# Altium schematic sheet PPC405_RAM.SCHDOC: FPGA PPC405 RAM example
size C; Organization: Altium Limited; Address1: L3, 12a Rodborough Rd; Address2: Frenchs Forest; Address3: NSW; Address4: Australia 2086; DocumentNumber: 1; SheetNumber: 1; SheetTotal: 1
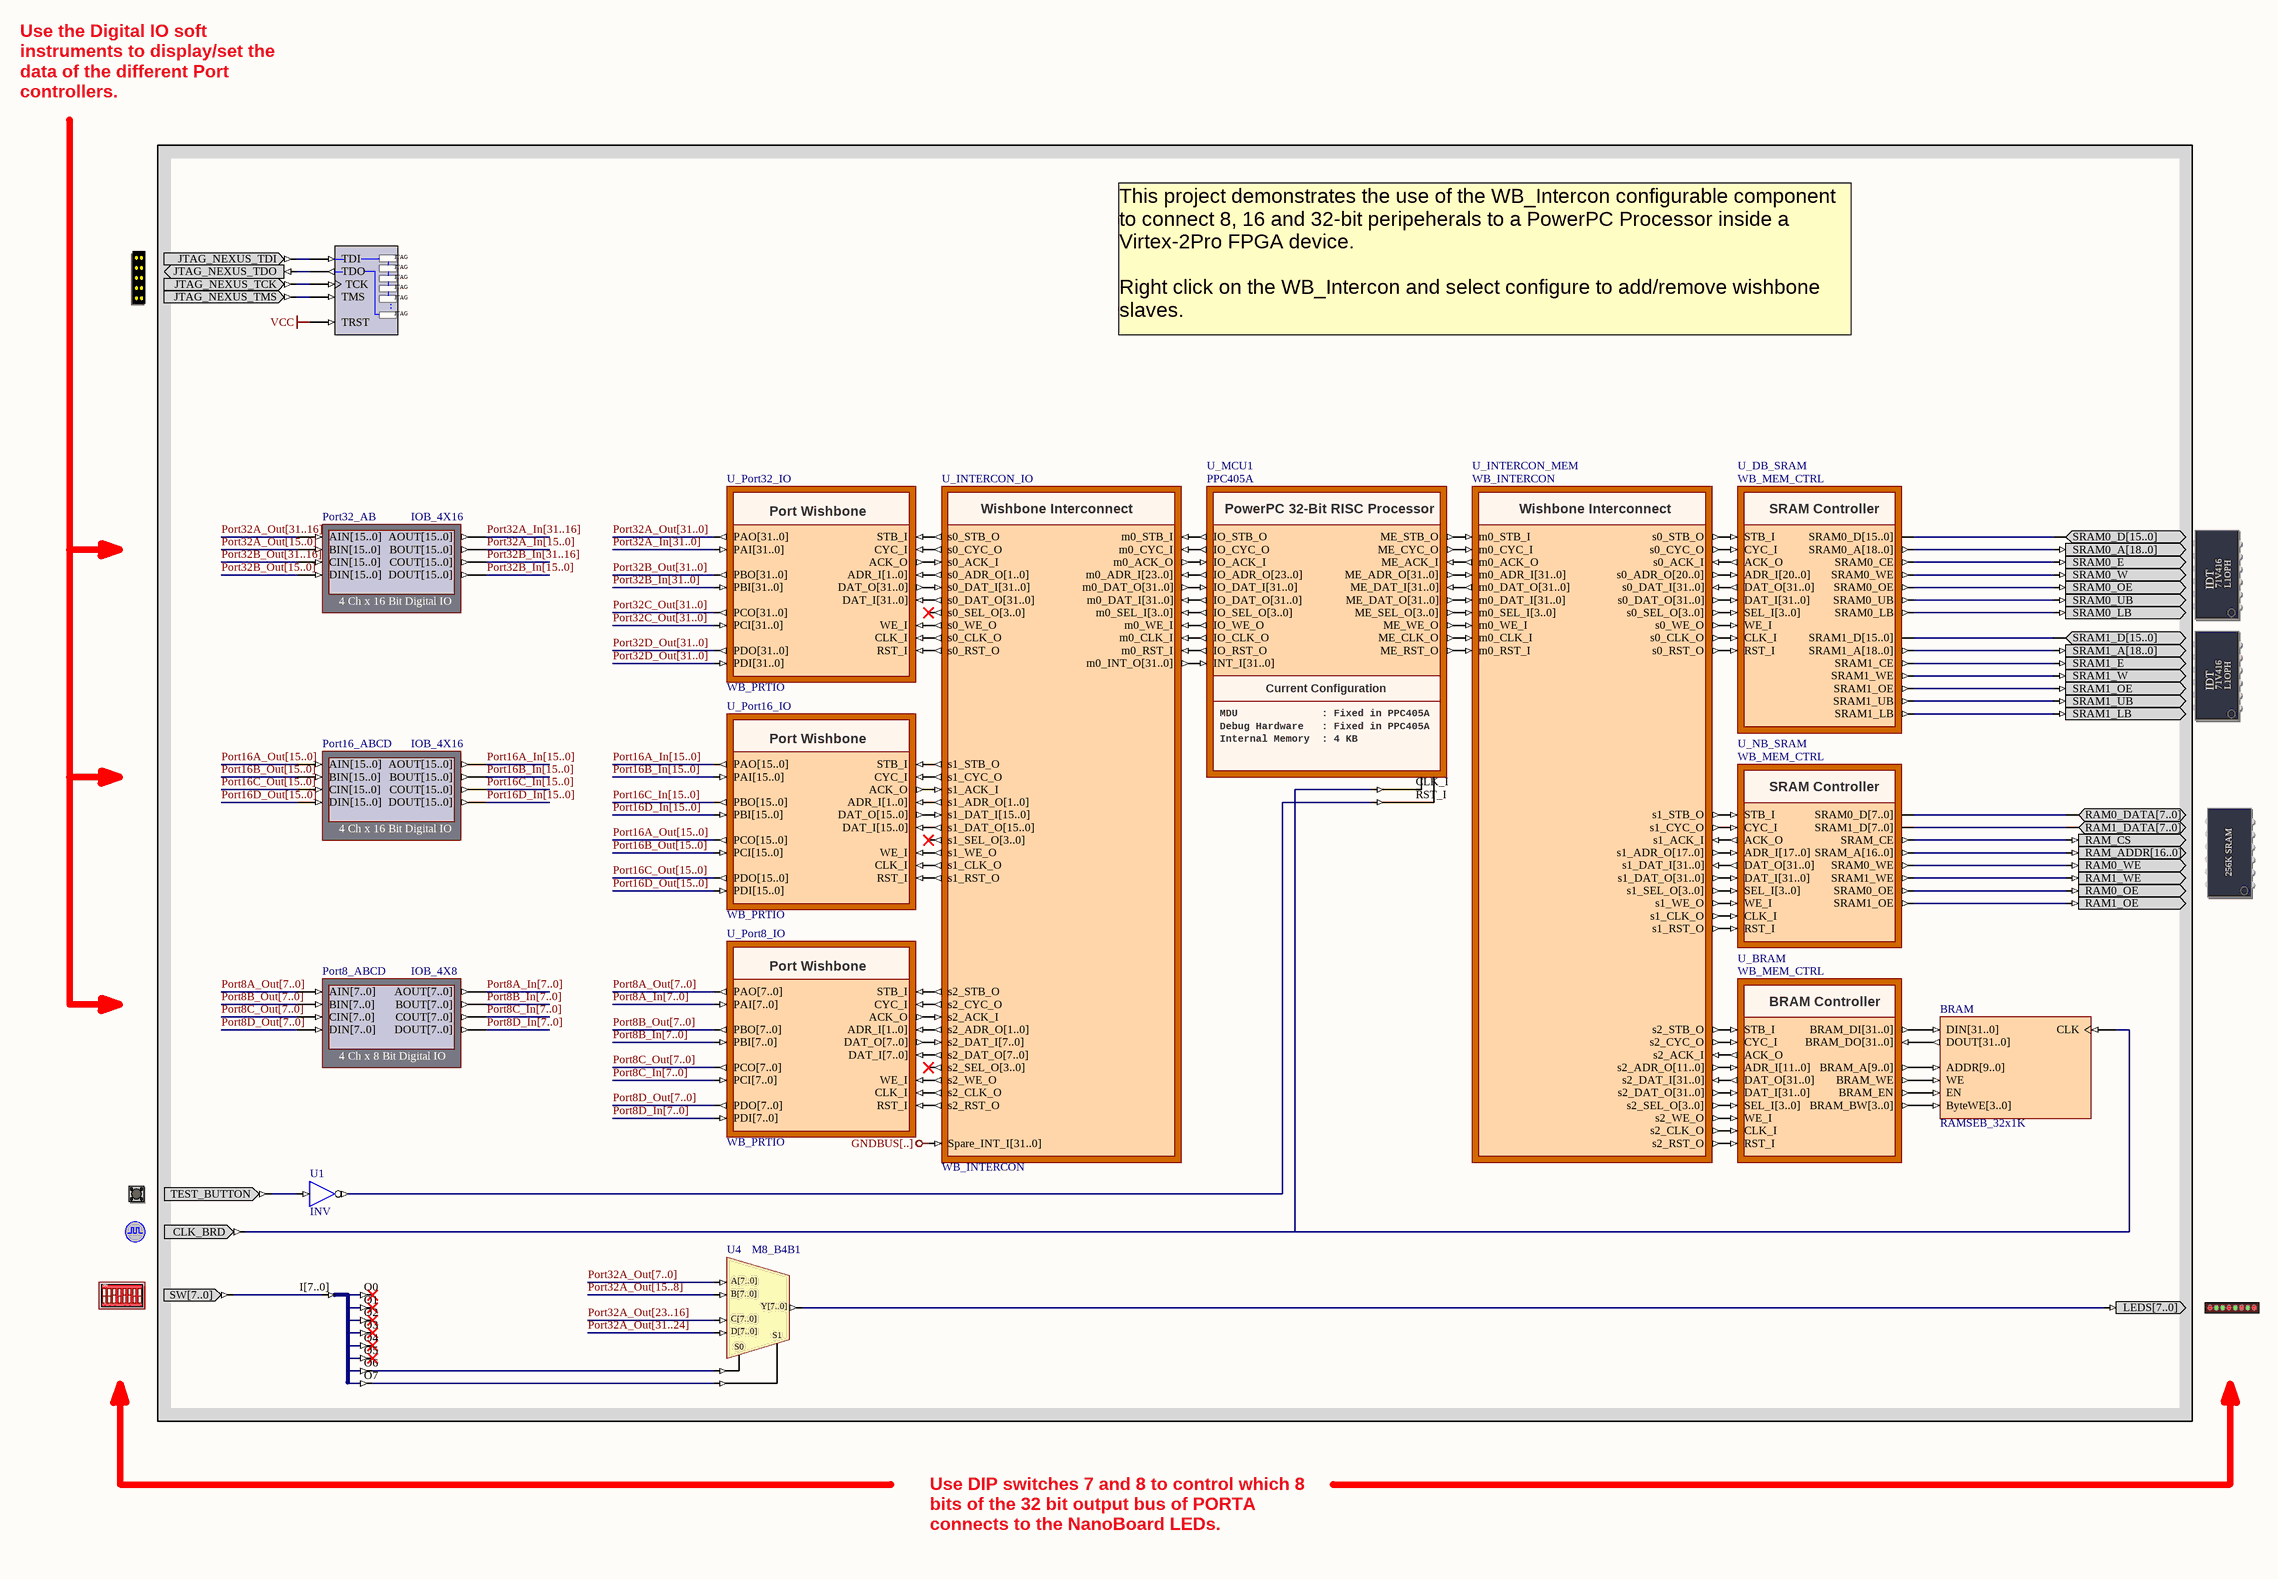
[diagram p0: PPC405_RAM.SCHDOC]

## Parts
(Parts that share a designator on the sheet are numbered #1, #2 ... from top to bottom, then left to right.)
?#1  NEXUS_JTAG_CONNECTOR  (value not drawn)
?#2  SRAM_DAUGHTER0  (value not drawn)
?#3  SRAM_DAUGHTER1  (value not drawn)
?#4  MEMORY256KX8  (value not drawn)
?#5  TEST_BUTTON  (value not drawn)
?#6  CLOCK_BOARD  (value not drawn)
?#7  DIPSWITCH  (value not drawn)
?#8  LED  (value not drawn)
BRAM  RAMSEB_32x1K
NEXUS_JTAG_PORT  NEXUS_JTAG_PORT  (value not drawn)
Port8_ABCD  IOB_4X8
Port16_ABCD  IOB_4X16
Port32_AB  IOB_4X16
U1  INV
U4  M8_B4B1
U11  J8B_8S  (value not drawn)
U_BRAM  WB_MEM_CTRL
U_DB_SRAM  WB_MEM_CTRL
U_INTERCON_IO  WB_INTERCON
U_INTERCON_MEM  WB_INTERCON
U_MCU1  PPC405A
U_NB_SRAM  WB_MEM_CTRL
U_Port8_IO  WB_PRTIO
U_Port16_IO  WB_PRTIO
U_Port32_IO  WB_PRTIO

## Nets
GNDBUS[..]: U_INTERCON_IO.Spare_INT_I[31..0]
VCC: NEXUS_JTAG_PORT.TRST
Port8A_In[7..0]: Port8_ABCD.AOUT[7..0] U_Port8_IO.PAI[7..0]
Port8A_Out[7..0]: Port8_ABCD.AIN[7..0] U_Port8_IO.PAO[7..0]
Port8B_In[7..0]: Port8_ABCD.BOUT[7..0] U_Port8_IO.PBI[7..0]
Port8B_Out[7..0]: Port8_ABCD.BIN[7..0] U_Port8_IO.PBO[7..0]
Port8C_In[7..0]: Port8_ABCD.COUT[7..0] U_Port8_IO.PCI[7..0]
Port8C_Out[7..0]: Port8_ABCD.CIN[7..0] U_Port8_IO.PCO[7..0]
Port8D_In[7..0]: Port8_ABCD.DOUT[7..0] U_Port8_IO.PDI[7..0]
Port8D_Out[7..0]: Port8_ABCD.DIN[7..0] U_Port8_IO.PDO[7..0]
Port16A_In[15..0]: Port16_ABCD.AOUT[15..0] U_Port16_IO.PAO[15..0]
Port16A_Out[15..0]: Port16_ABCD.AIN[15..0] U_Port16_IO.PCO[15..0]
Port16B_In[15..0]: Port16_ABCD.BOUT[15..0] U_Port16_IO.PAI[15..0]
Port16B_Out[15..0]: Port16_ABCD.BIN[15..0] U_Port16_IO.PCI[15..0]
Port16C_In[15..0]: Port16_ABCD.COUT[15..0] U_Port16_IO.PBO[15..0]
Port16C_Out[15..0]: Port16_ABCD.CIN[15..0] U_Port16_IO.PDO[15..0]
Port16D_In[15..0]: Port16_ABCD.DOUT[15..0] U_Port16_IO.PBI[15..0]
Port16D_Out[15..0]: Port16_ABCD.DIN[15..0] U_Port16_IO.PDI[15..0]
Port32A_In[15..0]: Port32_AB.BOUT[15..0]
Port32A_In[31..0]: U_Port32_IO.PAI[31..0]
Port32A_In[31..16]: Port32_AB.AOUT[15..0]
Port32A_Out[7..0]: U4.A[7..0]
Port32A_Out[15..0]: Port32_AB.BIN[15..0]
Port32A_Out[15..8]: U4.B[7..0]
Port32A_Out[23..16]: U4.C[7..0]
Port32A_Out[31..0]: U_Port32_IO.PAO[31..0]
Port32A_Out[31..16]: Port32_AB.AIN[15..0]
Port32A_Out[31..24]: U4.D[7..0]
Port32B_In[15..0]: Port32_AB.DOUT[15..0]
Port32B_In[31..0]: U_Port32_IO.PBI[31..0]
Port32B_In[31..16]: Port32_AB.COUT[15..0]
Port32B_Out[15..0]: Port32_AB.DIN[15..0]
Port32B_Out[31..0]: U_Port32_IO.PBO[31..0]
Port32B_Out[31..16]: Port32_AB.CIN[15..0]
Port32C_Out[31..0]: U_Port32_IO.PCI[31..0] U_Port32_IO.PCO[31..0]
Port32D_Out[31..0]: U_Port32_IO.PDI[31..0] U_Port32_IO.PDO[31..0]
Net?#1_JTAG_NEXUS_TCK: ?#1.JTAG_NEXUS_TCK NEXUS_JTAG_PORT.TCK
Net?#1_JTAG_NEXUS_TDI: ?#1.JTAG_NEXUS_TDI NEXUS_JTAG_PORT.TDI
Net?#1_JTAG_NEXUS_TDO: ?#1.JTAG_NEXUS_TDO NEXUS_JTAG_PORT.TDO
Net?#1_JTAG_NEXUS_TMS: ?#1.JTAG_NEXUS_TMS NEXUS_JTAG_PORT.TMS
Net?#2_SRAM0_A[18..0]: ?#2.SRAM0_A[18..0] U_DB_SRAM.SRAM0_A[18..0]
Net?#2_SRAM0_D[15..0]: ?#2.SRAM0_D[15..0] U_DB_SRAM.SRAM0_D[15..0]
Net?#2_SRAM0_E: ?#2.SRAM0_E U_DB_SRAM.SRAM0_CE
Net?#2_SRAM0_LB: ?#2.SRAM0_LB U_DB_SRAM.SRAM0_LB
Net?#2_SRAM0_OE: ?#2.SRAM0_OE U_DB_SRAM.SRAM0_OE
Net?#2_SRAM0_UB: ?#2.SRAM0_UB U_DB_SRAM.SRAM0_UB
Net?#2_SRAM0_W: ?#2.SRAM0_W U_DB_SRAM.SRAM0_WE
Net?#3_SRAM1_A[18..0]: ?#3.SRAM1_A[18..0] U_DB_SRAM.SRAM1_A[18..0]
Net?#3_SRAM1_D[15..0]: ?#3.SRAM1_D[15..0] U_DB_SRAM.SRAM1_D[15..0]
Net?#3_SRAM1_E: ?#3.SRAM1_E U_DB_SRAM.SRAM1_CE
Net?#3_SRAM1_LB: ?#3.SRAM1_LB U_DB_SRAM.SRAM1_LB
Net?#3_SRAM1_OE: ?#3.SRAM1_OE U_DB_SRAM.SRAM1_OE
Net?#3_SRAM1_UB: ?#3.SRAM1_UB U_DB_SRAM.SRAM1_UB
Net?#3_SRAM1_W: ?#3.SRAM1_W U_DB_SRAM.SRAM1_WE
Net?#4_RAM0_DATA[7..0]: ?#4.RAM0_DATA[7..0] U_NB_SRAM.SRAM0_D[7..0]
Net?#4_RAM0_OE: ?#4.RAM0_OE U_NB_SRAM.SRAM0_OE
Net?#4_RAM0_WE: ?#4.RAM0_WE U_NB_SRAM.SRAM0_WE
Net?#4_RAM1_DATA[7..0]: ?#4.RAM1_DATA[7..0] U_NB_SRAM.SRAM1_D[7..0]
Net?#4_RAM1_OE: ?#4.RAM1_OE U_NB_SRAM.SRAM1_OE
Net?#4_RAM1_WE: ?#4.RAM1_WE U_NB_SRAM.SRAM1_WE
Net?#4_RAM_ADDR[16..0]: ?#4.RAM_ADDR[16..0] U_NB_SRAM.SRAM_A[16..0]
Net?#4_RAM_CS: ?#4.RAM_CS U_NB_SRAM.SRAM_CE
Net?#5_TEST_BUTTON: ?#5.TEST_BUTTON U1.I
Net?#6_CLK_BRD: ?#6.CLK_BRD BRAM.CLK U_MCU1.CLK_I
Net?#7_SW[7..0]: ?#7.SW[7..0] U11.I[7..0]
Net?#8_LEDS[7..0]: ?#8.LEDS[7..0] U4.Y[7..0]
NetBRAM_ADDR[9..0]: BRAM.ADDR[9..0] U_BRAM.BRAM_A[9..0]
NetBRAM_ByteWE[3..0]: BRAM.ByteWE[3..0] U_BRAM.BRAM_BW[3..0]
NetBRAM_DIN[31..0]: BRAM.DIN[31..0] U_BRAM.BRAM_DI[31..0]
NetBRAM_DOUT[31..0]: BRAM.DOUT[31..0] U_BRAM.BRAM_DO[31..0]
NetBRAM_EN: BRAM.EN U_BRAM.BRAM_EN
NetBRAM_WE: BRAM.WE U_BRAM.BRAM_WE
NetU1_O: U1.O U_MCU1.RST_I
NetU4_S0: U4.S0 U11.O6
NetU4_S1: U4.S1 U11.O7
NetU_BRAM_ACK_O: U_BRAM.ACK_O U_INTERCON_MEM.s2_ACK_I
NetU_BRAM_ADR_I[11..0]: U_BRAM.ADR_I[11..0] U_INTERCON_MEM.s2_ADR_O[11..0]
NetU_BRAM_CLK_I: U_BRAM.CLK_I U_INTERCON_MEM.s2_CLK_O
NetU_BRAM_CYC_I: U_BRAM.CYC_I U_INTERCON_MEM.s2_CYC_O
NetU_BRAM_DAT_I[31..0]: U_BRAM.DAT_I[31..0] U_INTERCON_MEM.s2_DAT_O[31..0]
NetU_BRAM_DAT_O[31..0]: U_BRAM.DAT_O[31..0] U_INTERCON_MEM.s2_DAT_I[31..0]
NetU_BRAM_RST_I: U_BRAM.RST_I U_INTERCON_MEM.s2_RST_O
NetU_BRAM_SEL_I[3..0]: U_BRAM.SEL_I[3..0] U_INTERCON_MEM.s2_SEL_O[3..0]
NetU_BRAM_STB_I: U_BRAM.STB_I U_INTERCON_MEM.s2_STB_O
NetU_BRAM_WE_I: U_BRAM.WE_I U_INTERCON_MEM.s2_WE_O
NetU_DB_SRAM_ACK_O: U_DB_SRAM.ACK_O U_INTERCON_MEM.s0_ACK_I
NetU_DB_SRAM_ADR_I[20..0]: U_DB_SRAM.ADR_I[20..0] U_INTERCON_MEM.s0_ADR_O[20..0]
NetU_DB_SRAM_CLK_I: U_DB_SRAM.CLK_I U_INTERCON_MEM.s0_CLK_O
NetU_DB_SRAM_CYC_I: U_DB_SRAM.CYC_I U_INTERCON_MEM.s0_CYC_O
NetU_DB_SRAM_DAT_I[31..0]: U_DB_SRAM.DAT_I[31..0] U_INTERCON_MEM.s0_DAT_O[31..0]
NetU_DB_SRAM_DAT_O[31..0]: U_DB_SRAM.DAT_O[31..0] U_INTERCON_MEM.s0_DAT_I[31..0]
NetU_DB_SRAM_RST_I: U_DB_SRAM.RST_I U_INTERCON_MEM.s0_RST_O
NetU_DB_SRAM_SEL_I[3..0]: U_DB_SRAM.SEL_I[3..0] U_INTERCON_MEM.s0_SEL_O[3..0]
NetU_DB_SRAM_STB_I: U_DB_SRAM.STB_I U_INTERCON_MEM.s0_STB_O
NetU_DB_SRAM_WE_I: U_DB_SRAM.WE_I U_INTERCON_MEM.s0_WE_O
NetU_INTERCON_IO_m0_ACK_O: U_INTERCON_IO.m0_ACK_O U_MCU1.IO_ACK_I
NetU_INTERCON_IO_m0_ADR_I[23..0]: U_INTERCON_IO.m0_ADR_I[23..0] U_MCU1.IO_ADR_O[23..0]
NetU_INTERCON_IO_m0_CLK_I: U_INTERCON_IO.m0_CLK_I U_MCU1.IO_CLK_O
NetU_INTERCON_IO_m0_CYC_I: U_INTERCON_IO.m0_CYC_I U_MCU1.IO_CYC_O
NetU_INTERCON_IO_m0_DAT_I[31..0]: U_INTERCON_IO.m0_DAT_I[31..0] U_MCU1.IO_DAT_O[31..0]
NetU_INTERCON_IO_m0_DAT_O[31..0]: U_INTERCON_IO.m0_DAT_O[31..0] U_MCU1.IO_DAT_I[31..0]
NetU_INTERCON_IO_m0_INT_O[31..0]: U_INTERCON_IO.m0_INT_O[31..0] U_MCU1.INT_I[31..0]
NetU_INTERCON_IO_m0_RST_I: U_INTERCON_IO.m0_RST_I U_MCU1.IO_RST_O
NetU_INTERCON_IO_m0_SEL_I[3..0]: U_INTERCON_IO.m0_SEL_I[3..0] U_MCU1.IO_SEL_O[3..0]
NetU_INTERCON_IO_m0_STB_I: U_INTERCON_IO.m0_STB_I U_MCU1.IO_STB_O
NetU_INTERCON_IO_m0_WE_I: U_INTERCON_IO.m0_WE_I U_MCU1.IO_WE_O
NetU_INTERCON_IO_s0_ACK_I: U_INTERCON_IO.s0_ACK_I U_Port32_IO.ACK_O
NetU_INTERCON_IO_s0_ADR_O[1..0]: U_INTERCON_IO.s0_ADR_O[1..0] U_Port32_IO.ADR_I[1..0]
NetU_INTERCON_IO_s0_CLK_O: U_INTERCON_IO.s0_CLK_O U_Port32_IO.CLK_I
NetU_INTERCON_IO_s0_CYC_O: U_INTERCON_IO.s0_CYC_O U_Port32_IO.CYC_I
NetU_INTERCON_IO_s0_DAT_I[31..0]: U_INTERCON_IO.s0_DAT_I[31..0] U_Port32_IO.DAT_O[31..0]
NetU_INTERCON_IO_s0_DAT_O[31..0]: U_INTERCON_IO.s0_DAT_O[31..0] U_Port32_IO.DAT_I[31..0]
NetU_INTERCON_IO_s0_RST_O: U_INTERCON_IO.s0_RST_O U_Port32_IO.RST_I
NetU_INTERCON_IO_s0_STB_O: U_INTERCON_IO.s0_STB_O U_Port32_IO.STB_I
NetU_INTERCON_IO_s0_WE_O: U_INTERCON_IO.s0_WE_O U_Port32_IO.WE_I
NetU_INTERCON_IO_s1_ACK_I: U_INTERCON_IO.s1_ACK_I U_Port16_IO.ACK_O
NetU_INTERCON_IO_s1_ADR_O[1..0]: U_INTERCON_IO.s1_ADR_O[1..0] U_Port16_IO.ADR_I[1..0]
NetU_INTERCON_IO_s1_CLK_O: U_INTERCON_IO.s1_CLK_O U_Port16_IO.CLK_I
NetU_INTERCON_IO_s1_CYC_O: U_INTERCON_IO.s1_CYC_O U_Port16_IO.CYC_I
NetU_INTERCON_IO_s1_DAT_I[15..0]: U_INTERCON_IO.s1_DAT_I[15..0] U_Port16_IO.DAT_O[15..0]
NetU_INTERCON_IO_s1_DAT_O[15..0]: U_INTERCON_IO.s1_DAT_O[15..0] U_Port16_IO.DAT_I[15..0]
NetU_INTERCON_IO_s1_RST_O: U_INTERCON_IO.s1_RST_O U_Port16_IO.RST_I
NetU_INTERCON_IO_s1_STB_O: U_INTERCON_IO.s1_STB_O U_Port16_IO.STB_I
NetU_INTERCON_IO_s1_WE_O: U_INTERCON_IO.s1_WE_O U_Port16_IO.WE_I
NetU_INTERCON_IO_s2_ACK_I: U_INTERCON_IO.s2_ACK_I U_Port8_IO.ACK_O
NetU_INTERCON_IO_s2_ADR_O[1..0]: U_INTERCON_IO.s2_ADR_O[1..0] U_Port8_IO.ADR_I[1..0]
NetU_INTERCON_IO_s2_CLK_O: U_INTERCON_IO.s2_CLK_O U_Port8_IO.CLK_I
NetU_INTERCON_IO_s2_CYC_O: U_INTERCON_IO.s2_CYC_O U_Port8_IO.CYC_I
NetU_INTERCON_IO_s2_DAT_I[7..0]: U_INTERCON_IO.s2_DAT_I[7..0] U_Port8_IO.DAT_O[7..0]
NetU_INTERCON_IO_s2_DAT_O[7..0]: U_INTERCON_IO.s2_DAT_O[7..0] U_Port8_IO.DAT_I[7..0]
NetU_INTERCON_IO_s2_RST_O: U_INTERCON_IO.s2_RST_O U_Port8_IO.RST_I
NetU_INTERCON_IO_s2_STB_O: U_INTERCON_IO.s2_STB_O U_Port8_IO.STB_I
NetU_INTERCON_IO_s2_WE_O: U_INTERCON_IO.s2_WE_O U_Port8_IO.WE_I
NetU_INTERCON_MEM_m0_ACK_O: U_INTERCON_MEM.m0_ACK_O U_MCU1.ME_ACK_I
NetU_INTERCON_MEM_m0_ADR_I[31..0]: U_INTERCON_MEM.m0_ADR_I[31..0] U_MCU1.ME_ADR_O[31..0]
NetU_INTERCON_MEM_m0_CLK_I: U_INTERCON_MEM.m0_CLK_I U_MCU1.ME_CLK_O
NetU_INTERCON_MEM_m0_CYC_I: U_INTERCON_MEM.m0_CYC_I U_MCU1.ME_CYC_O
NetU_INTERCON_MEM_m0_DAT_I[31..0]: U_INTERCON_MEM.m0_DAT_I[31..0] U_MCU1.ME_DAT_O[31..0]
NetU_INTERCON_MEM_m0_DAT_O[31..0]: U_INTERCON_MEM.m0_DAT_O[31..0] U_MCU1.ME_DAT_I[31..0]
NetU_INTERCON_MEM_m0_RST_I: U_INTERCON_MEM.m0_RST_I U_MCU1.ME_RST_O
NetU_INTERCON_MEM_m0_SEL_I[3..0]: U_INTERCON_MEM.m0_SEL_I[3..0] U_MCU1.ME_SEL_O[3..0]
NetU_INTERCON_MEM_m0_STB_I: U_INTERCON_MEM.m0_STB_I U_MCU1.ME_STB_O
NetU_INTERCON_MEM_m0_WE_I: U_INTERCON_MEM.m0_WE_I U_MCU1.ME_WE_O
NetU_INTERCON_MEM_s1_ACK_I: U_INTERCON_MEM.s1_ACK_I U_NB_SRAM.ACK_O
NetU_INTERCON_MEM_s1_ADR_O[17..0]: U_INTERCON_MEM.s1_ADR_O[17..0] U_NB_SRAM.ADR_I[17..0]
NetU_INTERCON_MEM_s1_CLK_O: U_INTERCON_MEM.s1_CLK_O U_NB_SRAM.CLK_I
NetU_INTERCON_MEM_s1_CYC_O: U_INTERCON_MEM.s1_CYC_O U_NB_SRAM.CYC_I
NetU_INTERCON_MEM_s1_DAT_I[31..0]: U_INTERCON_MEM.s1_DAT_I[31..0] U_NB_SRAM.DAT_O[31..0]
NetU_INTERCON_MEM_s1_DAT_O[31..0]: U_INTERCON_MEM.s1_DAT_O[31..0] U_NB_SRAM.DAT_I[31..0]
NetU_INTERCON_MEM_s1_RST_O: U_INTERCON_MEM.s1_RST_O U_NB_SRAM.RST_I
NetU_INTERCON_MEM_s1_SEL_O[3..0]: U_INTERCON_MEM.s1_SEL_O[3..0] U_NB_SRAM.SEL_I[3..0]
NetU_INTERCON_MEM_s1_STB_O: U_INTERCON_MEM.s1_STB_O U_NB_SRAM.STB_I
NetU_INTERCON_MEM_s1_WE_O: U_INTERCON_MEM.s1_WE_O U_NB_SRAM.WE_I

Not connected (* = marked no-connect by the designer): U11 O0* O1* O2* O3* O4* O5*; U_INTERCON_IO s0_SEL_O[3..0]* s1_SEL_O[3..0]* s2_SEL_O[3..0]*

## Buses and harness runs
bus Port8A_In[7..0]
bus Port8A_Out[7..0]
bus Port8B_In[7..0]
bus Port8B_Out[7..0]
bus Port8C_In[7..0]
bus Port8C_Out[7..0]
bus Port8D_In[7..0]
bus Port8D_Out[7..0]
bus Port16A_In[15..0]
bus Port16A_Out[15..0]
bus Port16B_In[15..0]
bus Port16B_Out[15..0]
bus Port16C_In[15..0]
bus Port16C_Out[15..0]
bus Port16D_In[15..0]
bus Port16D_Out[15..0]
bus Port32A_In[15..0]
bus Port32A_In[31..0]
bus Port32A_In[31..16]
bus Port32A_Out[7..0]
bus Port32A_Out[15..0]
bus Port32A_Out[15..8]
bus Port32A_Out[23..16]
bus Port32A_Out[31..0]
bus Port32A_Out[31..16]
bus Port32A_Out[31..24]
bus Port32B_In[15..0]
bus Port32B_In[31..0]
bus Port32B_In[31..16]
bus Port32B_Out[15..0]
bus Port32B_Out[31..0]
bus Port32B_Out[31..16]
bus Port32C_Out[31..0]
bus Port32D_Out[31..0]

## Notes on the sheet
- Use the Digital IO soft instruments to display/set the data of the different Port controllers.
- This project demonstrates the use of the WB_Intercon configurable component to connect 8, 16 and 32-bit peripeherals to a PowerPC Processor inside a Virtex-2Pro FPGA device.
  Right click on the WB_Intercon and select configure to add/remove wishbone slaves.
- Use DIP switches 7 and 8 to control which 8 bits of the 32 bit output bus of PORTA connects to the NanoBoard LEDs.
- Title
- Size:
- Date:
- File:
- C
- Number:
- Time:
- Revision:
- Sheet
- of
- (in symbol DIPSWITCH) ON; 1; 2; 3; 4; 5; 6; 7; 8
- (in symbol MEMORY256KX8) 256K SRAM
- (in symbol NEXUS_JTAG_PORT) JTAG; .
- (in symbol PPC405A) PowerPC 32-Bit RISC Processor; Current Configuration; MDU              : Fixed in PPC405A; Debug Hardware   : Fixed in PPC405A; Internal Memory  : 4 KB
- (in symbol SRAM_DAUGHTER0) IDT; 71V416; L1OPH
- (in symbol SRAM_DAUGHTER1) IDT; 71V416; L1OPH
- (in symbol WB_INTERCON) Wishbone Interconnect
- (in symbol WB_MEM_CTRL) BRAM Controller; SRAM Controller
- (in symbol WB_PRTIO) Port Wishbone

## Library data of the parts
?#1 = NEXUS_JTAG_CONNECTOR: JTAG Port; PortComponent: True; Published: 19-Nov-2003; Publisher: Altium Limited
?#2 = SRAM_DAUGHTER0: SRAM - 0 Module - Daughterboard; PortComponent: True; Published: 13-May-2004; Publisher: Altium Limited
?#3 = SRAM_DAUGHTER1: SRAM - 1 Module - Daughterboard; PortComponent: True; Published: 13-May-2004; Publisher: Altium Limited
?#4 = MEMORY256KX8: SRAM 256kx8; PortComponent: True; Published: 19-Nov-2003; Publisher: Altium Limited; HelpURL: TR0102 NanoBoard Technical Reference Manual - NB1.pdf#page=33
?#5 = TEST_BUTTON: Test Button; PortComponent: True; Published: 19-Nov-2003; Publisher: Altium Limited
?#6 = CLOCK_BOARD: Global System Clock Supply; PortComponent: True; Published: 19-Nov-2003; Publisher: Altium Limited
?#7 = DIPSWITCH: 8-Way Dip Switch; PortComponent: True; Published: 19-Nov-2003; Publisher: Altium Limited
?#8 = LED: 8-Way LEDS; PortComponent: True; Published: 19-Nov-2003; Publisher: Altium Limited
BRAM = RAMSEB_32x1K: Single Port RAM, Enable, Byte Write Enable; Memory_Type: RAM_SinglePortBlock; Memory_ClockEdge: Rising; Nexus_Core: Memory_Program; Memory_EnablePin: True; Memory_Depth: 1024; Memory_Width: 32; Published: 11/10/2004; Publisher: Altium Hobart Technology Center; Memory_ByteWrites: True
NEXUS_JTAG_PORT = NEXUS_JTAG_PORT: Soft Nexus-Chain Connector; NEXUS_JTAG_CONNECTOR: True; Published: 18-Dec-2003; Publisher: Altium Limited
Port8_ABCD = IOB_4X8: 4 Ch x 8 Bit Digital IO; NEXUS_CORE: Instrument; NEXUS_JTAG_DEVICE: True; NEXUS_JTAG_ORDER: 50; Published: 3-Nov-2004; Publisher: Altium Limited; ComponentLink1Description: Core &Resource Usage; ComponentLink1URL: CR0134 FPGA Instrument Resource Usage.pdf#page=8; HelpURL: CR0102 IOB_x Digital IO Module.pdf#page=2; LastRevisionNo: 1.00.00
Port16_ABCD = IOB_4X16: 4 Ch x 16 Bit Digital IO; NEXUS_CORE: Instrument; NEXUS_JTAG_DEVICE: True; NEXUS_JTAG_ORDER: 40; Published: 3-Nov-2004; Publisher: Altium Limited; ComponentLink1Description: Core &Resource Usage; ComponentLink1URL: CR0134 FPGA Instrument Resource Usage.pdf#page=9; HelpURL: CR0102 IOB_x Digital IO Module.pdf#page=2; LastRevisionNo: 1.00.00
Port32_AB = IOB_4X16: 4 Ch x 16 Bit Digital IO; NEXUS_CORE: Instrument; NEXUS_JTAG_DEVICE: True; NEXUS_JTAG_ORDER: 30; Published: 3-Nov-2004; Publisher: Altium Limited; ComponentLink1Description: Core &Resource Usage; ComponentLink1URL: CR0134 FPGA Instrument Resource Usage.pdf#page=9; HelpURL: CR0102 IOB_x Digital IO Module.pdf#page=2; LastRevisionNo: 1.00.00
U1 = INV: Inverter; ArchiveName: GENERIC; FunctionalClass: Logic Primitive; VHDLIB_SIM: GENERIC_LIB; Published: 29-Jan-2004; Publisher: Altium Limited; ComponentLink1Description: Core &Resource Usage; ComponentLink1URL: CR0136 FPGA Logic Primitive Resource Usage.pdf#page=61; HelpURL: CR0118 FPGA Generic Library Guide.pdf#page=290; LastRevisionNo: 1.00.00; SubClass: INV; XilinxEquivalent: INV
U4 = M8_B4B1: 4x8-Bit Bus to 1x8-Bit Bus Multiplexer; ArchiveName: GENERIC; VHDLIB_SIM: GENERIC_LIB; PortSize: 8; PortStyle: Bus Version; SubClass: BnB1; Published: 29-Jan-2004; Publisher: Altium Limited; HelpURL: CR0118 FPGA Generic Library Guide.pdf#page=364; ComponentLink1Description: Core &Resource Usage; ComponentLink1URL: CR0137 FPGA Multiplexer Resource Usage.pdf#page=304; FunctionalClass: Multiplexer; LastRevisionNo: 1.00.00
U11 = J8B_8S: 8-Bit input bus to 8 single pin outputs; ArchiveName: GENERIC; VHDLIB_SIM: GENERIC_LIB; FunctionalClass: Bus Joiner; PortSize: 8; Published: 29-Jan-2004; Publisher: Altium Limited; ComponentLink1Description: Core &Resource Usage; ComponentLink1URL: CR0126 FPGA Bus Joiner Resource Usage.pdf#page=27; HelpURL: CR0118 FPGA Generic Library Guide.pdf#page=303; LastRevisionNo: 1.00.00
U_BRAM = WB_MEM_CTRL: Configurable Memory Controller; ConfigurationParameters: {}Option_MemoryType[Block RAM]{}Option_MemorySize[4 Kb (1K x 32-bit)]{}Option_Layout[2 x 16-bit Wide Devices]{}Option_Read[2]{}Option_WriteSetup[1]{}Option_WritePulse[1]{}Option_WriteHold[1]{}; ComponentLink1Description: Core &Resource Usage; ComponentLink1URL: CR0139 FPGA Peripheral Resource Usage.pdf#page=58; HelpURL: CR0152 WB_MEM_CTRL Configurable Wishbone Memory Controller.pdf#page=2; LastRevisionNo: 1.00.00; Published: 9-Dec-2004; Publisher: Altium Limited; ConfiguratorName: WB_MEM_CTRL
U_DB_SRAM = WB_MEM_CTRL: Configurable Memory Controller; ConfigurationParameters: {}Option_MemoryType[Asynchronous SRAM]{}Option_MemorySize[2 Mb (512K x 32-bit)]{}Option_Layout[2 x 16-bit Wide Devices]{}Option_Read[2]{}Option_WriteSetup[1]{}Option_WritePulse[1]{}Option_WriteHold[1]{}; ComponentLink1Description: Core &Resource Usage; ComponentLink1URL: CR0139 FPGA Peripheral Resource Usage.pdf#page=58; HelpURL: CR0152 WB_MEM_CTRL Configurable Wishbone Memory Controller.pdf#page=2; LastRevisionNo: 1.00.00; Published: 9-Dec-2004; Publisher: Altium Limited; ConfiguratorName: WB_MEM_CTRL
U_INTERCON_IO = WB_INTERCON: Configurable Wishbone Interconnect; ConfigurationParameters: {}UnusedInterrupts[0]{}MasterAddressBits[1]{}Name0[Port32]{}Kind0[0]{}SpaceAfter0[8]{}Address_Base0[0]{}Address_UsedRange0[4]{}Address_Bits0[2]{}Address_Mode0[0]{}Address_DecodeWidth0[4]{}DataWidth0[0]{}UsedInterrupts0[]{}Name1[Port16]{}Kind1[0]{}SpaceAfter1[8]{}Address_Base1[1048576]{}Address_UsedRange1[4]{}Address_Bits1[2]{}Address_Mode1[0]{}Address_DecodeWidth1[4]{}DataWidth1[1]{}UsedInterrupts1[]{}Name2[Port8]{}Kind2[0]{}SpaceAfter2[2]{}Address_Base2[2097152]{}Address_UsedRange2[4]{}Address_Bits2[2]{}Address_Mode2[0]{}Address_DecodeWidth2[4]{}DataWidth2[2]{}UsedInterrupts2[]; ComponentLink1Description: Core &Resource Usage; ComponentLink1URL: CR0139 FPGA Peripheral Resource Usage.pdf#page=51; HelpURL: CR0150 WB_INTERCON Configurable Wishbone Interconnect.pdf#page=2; LastRevisionNo: 1.00.00; Published: 9-Dec-2004; Publisher: Altium Limited; ConfiguratorName: WB_INTERCON
U_INTERCON_MEM = WB_INTERCON: Configurable Wishbone Interconnect; ConfigurationParameters: {}UnusedInterrupts[2]{}MasterAddressBits[0]{}Name0[DB_RAM]{}Kind0[2]{}SpaceAfter0[12]{}Address_Base0[16777216]{}Address_UsedRange0[1]{}Address_Bits0[21]{}Address_Mode0[1]{}Address_DecodeWidth0[11]{}DataWidth0[0]{}UsedInterrupts0[]{}Name1[NB_RAM]{}Kind1[2]{}SpaceAfter1[7]{}Address_Base1[18874368]{}Address_UsedRange1[1]{}Address_Bits1[18]{}Address_Mode1[1]{}Address_DecodeWidth1[11]{}DataWidth1[0]{}UsedInterrupts1[]{}Name2[BRAM]{}Kind2[2]{}SpaceAfter2[12]{}Address_Base2[20971520]{}Address_UsedRange2[524288]{}Address_Bits2[12]{}Address_Mode2[1]{}Address_DecodeWidth2[11]{}DataWidth2[0]{}UsedInterrupts2[]; ComponentLink1Description: Core &Resource Usage; ComponentLink1URL: CR0139 FPGA Peripheral Resource Usage.pdf#page=51; HelpURL: CR0150 WB_INTERCON Configurable Wishbone Interconnect.pdf#page=2; LastRevisionNo: 1.00.00; Published: 9-Dec-2004; Publisher: Altium Limited; ConfiguratorName: WB_INTERCON
U_MCU1 = PPC405A: PowerPC PPC405 RISC Processor; ChildModel1: TSK3000A_MCU; Nexus_JTAG_Device: True; Nexus_Core: Processor_OCDS; Nexus_JTAG_Order: 10; ProgramLogicalTopAddress: 0; ChildModel2: TSK3000A_MDU; ChildModel3: TSK3000A_OCDS; ChildModel4: TSK3000A_Shift_Barrel; ChildModel5: TSK3000A_Shift_Sequential; ChildModel6: Mult_32x32; ConfigurationParameters: {}Option_Processor[1]{}Option_Memory[2]{}Option_MDU[0]{}Option_OCDS[0]{}Option_Shifter[0]{}Option_InterruptCount[32]{}Option_DebugWhenReset[0]{}; ChildModel7: m33x33; ConfiguratorName: FPGA_MCU32; ComponentLink1Description: Core &Resource Usage; ComponentLink1URL: CR0140 FPGA Processor Resource Usage.pdf#page=16; HelpURL: CR0121 TSK3000A 32 bit RISC Processor.pdf#page=6; LastRevisionNo: 1.00.00; Published: 17-Nov-2004; Publisher: Altium Limited
U_NB_SRAM = WB_MEM_CTRL: Configurable Memory Controller; ConfigurationParameters: {}Option_MemoryType[Asynchronous SRAM]{}Option_MemorySize[256 Kb (64K x 32-bit)]{}Option_Layout[2 x  8-bit Wide Devices]{}Option_Read[2]{}Option_WriteSetup[1]{}Option_WritePulse[1]{}Option_WriteHold[1]{}; ComponentLink1Description: Core &Resource Usage; ComponentLink1URL: CR0139 FPGA Peripheral Resource Usage.pdf#page=58; HelpURL: CR0152 WB_MEM_CTRL Configurable Wishbone Memory Controller.pdf#page=2; LastRevisionNo: 1.00.00; Published: 9-Dec-2004; Publisher: Altium Limited; ConfiguratorName: WB_MEM_CTRL
U_Port8_IO = WB_PRTIO: Configurable Port Wishbone; ChildModel: PRTIO4X8_W; ConfigurationParameters: {}PortCount[4]{}BusWidth[8]{}PortKind[0]{}; ComponentLink1Description: Core &Resource Usage; ComponentLink1URL: CR0139 FPGA Peripheral Resource Usage.pdf#page=63; HelpURL: CR0154 WB_PRTIO Configurable Wishbone Parallel Port Unit.pdf#page=2; LastRevisionNo: 1.00.00; Published: 9-Dec-2004; Publisher: Altium Limited; ConfiguratorName: WB_PRTIO
U_Port16_IO = WB_PRTIO: Configurable Port Wishbone; ChildModel: PRTIO4X16_W; ConfigurationParameters: {}PortCount[4]{}BusWidth[16]{}PortKind[0]{}; ComponentLink1Description: Core &Resource Usage; ComponentLink1URL: CR0139 FPGA Peripheral Resource Usage.pdf#page=63; HelpURL: CR0154 WB_PRTIO Configurable Wishbone Parallel Port Unit.pdf#page=2; LastRevisionNo: 1.00.00; Published: 9-Dec-2004; Publisher: Altium Limited; ConfiguratorName: WB_PRTIO
U_Port32_IO = WB_PRTIO: Configurable Port Wishbone; ChildModel: PRTIO4X32_W; ConfigurationParameters: {}PortCount[4]{}BusWidth[32]{}PortKind[0]{}; ComponentLink1Description: Core &Resource Usage; ComponentLink1URL: CR0139 FPGA Peripheral Resource Usage.pdf#page=63; HelpURL: CR0154 WB_PRTIO Configurable Wishbone Parallel Port Unit.pdf#page=2; LastRevisionNo: 1.00.00; Published: 9-Dec-2004; Publisher: Altium Limited; ConfiguratorName: WB_PRTIO